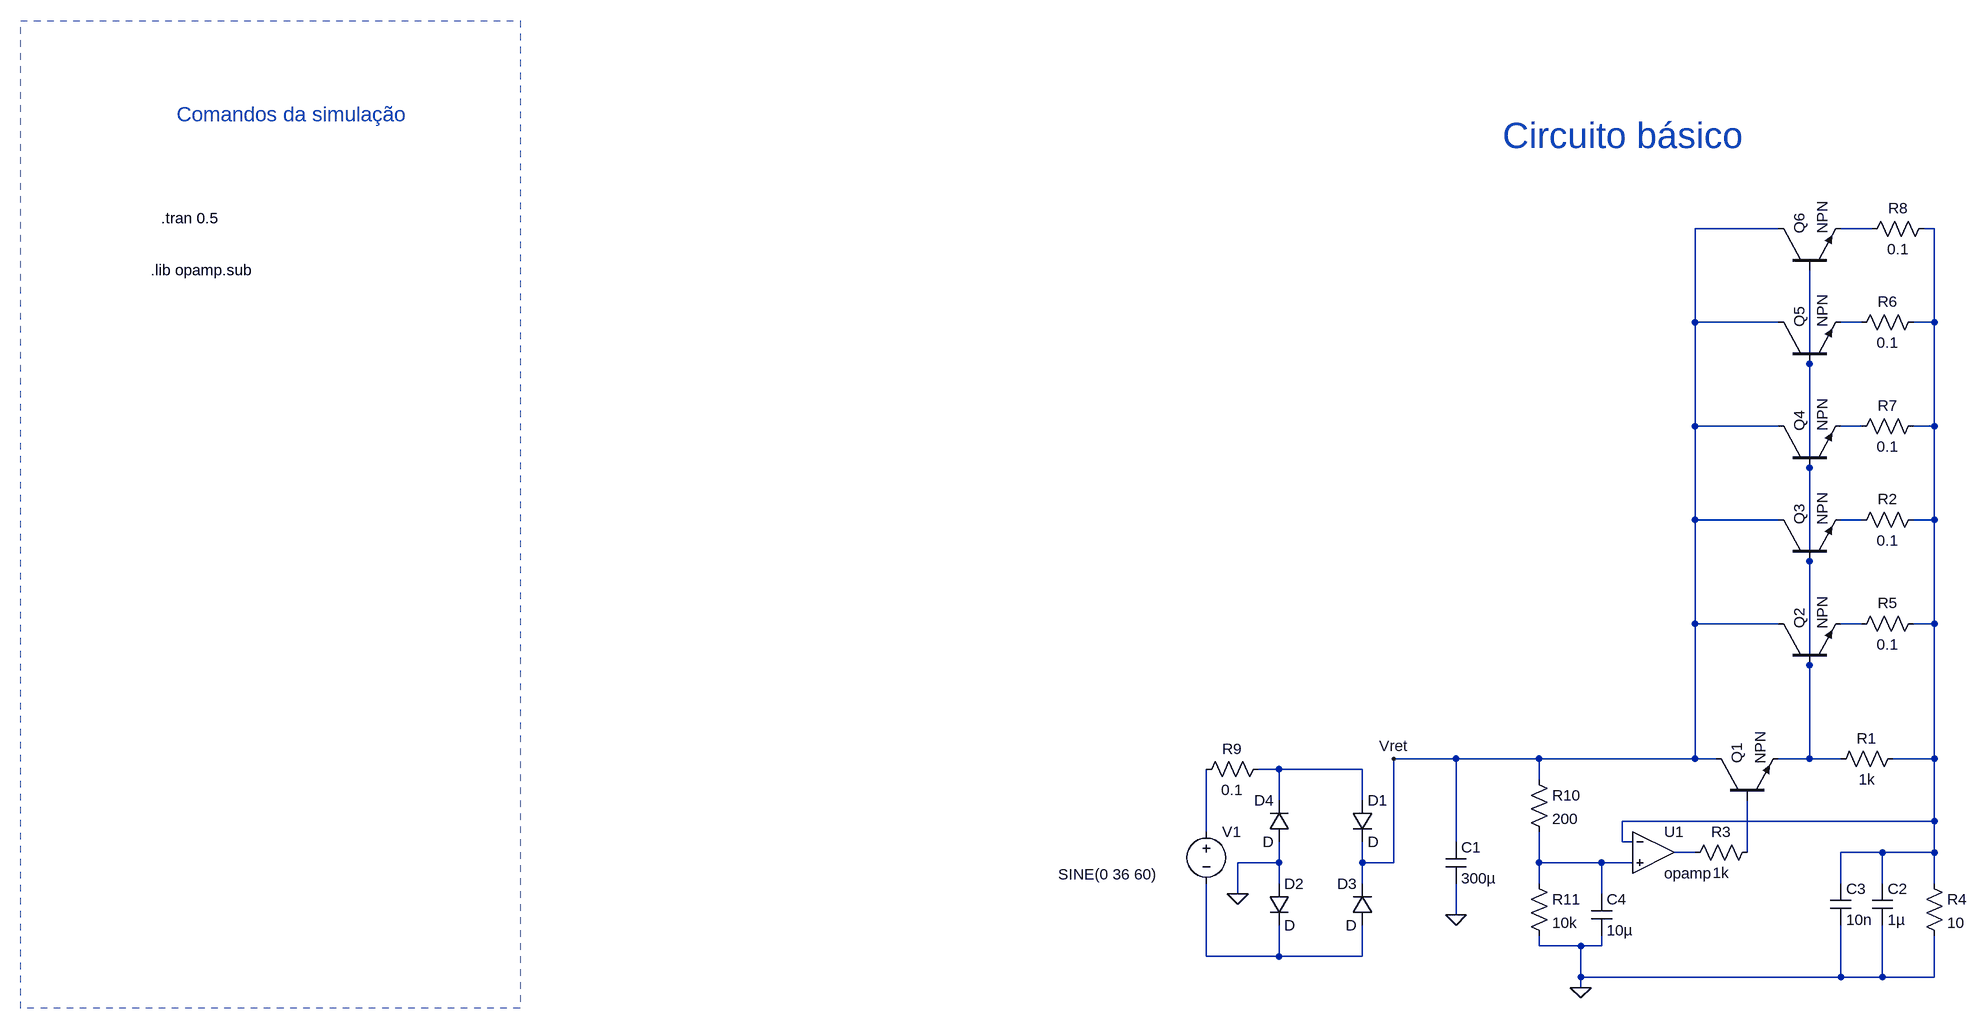
[diagram p0: schematic SimV1.asc]
SimV1.asc, the LTspice schematic file:
Version 4
SHEET 1 4884 2916
WIRE -64 240 -192 240
WIRE 80 240 32 240
WIRE 176 240 160 240
WIRE -192 384 -192 240
WIRE -64 384 -192 384
WIRE 64 384 32 384
WIRE 176 384 176 240
WIRE 176 384 144 384
WIRE -16 448 -16 304
WIRE -192 544 -192 384
WIRE -64 544 -192 544
WIRE 64 544 32 544
WIRE 176 544 176 384
WIRE 176 544 144 544
WIRE -16 608 -16 448
WIRE -192 688 -192 544
WIRE -64 688 -192 688
WIRE 64 688 32 688
WIRE 176 688 176 544
WIRE 176 688 144 688
WIRE -16 752 -16 608
WIRE -192 848 -192 688
WIRE -64 848 -192 848
WIRE 64 848 32 848
WIRE 176 848 176 688
WIRE 176 848 144 848
WIRE -16 912 -16 752
WIRE -560 1056 -656 1056
WIRE -432 1056 -560 1056
WIRE -192 1056 -192 848
WIRE -192 1056 -432 1056
WIRE -160 1056 -192 1056
WIRE -16 1056 -16 912
WIRE -16 1056 -64 1056
WIRE 32 1056 -16 1056
WIRE 176 1056 176 848
WIRE 176 1056 112 1056
WIRE -832 1072 -864 1072
WIRE -704 1072 -832 1072
WIRE -432 1088 -432 1056
WIRE -832 1120 -832 1072
WIRE -704 1120 -704 1072
WIRE 176 1152 176 1056
WIRE 176 1152 -304 1152
WIRE -944 1168 -944 1072
WIRE -560 1184 -560 1056
WIRE -304 1184 -304 1152
WIRE -288 1184 -304 1184
WIRE -192 1200 -224 1200
WIRE -112 1200 -112 1120
WIRE 96 1200 32 1200
WIRE 176 1200 176 1152
WIRE 176 1200 96 1200
WIRE -832 1216 -832 1184
WIRE -832 1216 -896 1216
WIRE -704 1216 -704 1184
WIRE -656 1216 -656 1056
WIRE -656 1216 -704 1216
WIRE -432 1216 -432 1168
WIRE -336 1216 -432 1216
WIRE -288 1216 -336 1216
WIRE -832 1248 -832 1216
WIRE -704 1248 -704 1216
WIRE -432 1248 -432 1216
WIRE 32 1248 32 1200
WIRE 96 1248 96 1200
WIRE 176 1248 176 1200
WIRE -896 1264 -896 1216
WIRE -336 1264 -336 1216
WIRE -560 1296 -560 1248
WIRE -432 1344 -432 1328
WIRE -368 1344 -432 1344
WIRE -336 1344 -336 1328
WIRE -336 1344 -368 1344
WIRE -944 1360 -944 1248
WIRE -832 1360 -832 1312
WIRE -832 1360 -944 1360
WIRE -704 1360 -704 1312
WIRE -704 1360 -832 1360
WIRE -368 1392 -368 1344
WIRE 32 1392 32 1312
WIRE 32 1392 -368 1392
WIRE 96 1392 96 1312
WIRE 96 1392 32 1392
WIRE 176 1392 176 1328
WIRE 176 1392 96 1392
WIRE -368 1408 -368 1392
FLAG -896 1264 0
FLAG -368 1408 0
FLAG -560 1296 0
FLAG -656 1056 Vret
SYMBOL OpAmps\\opamp -256 1136 R0
SYMATTR InstName U1
SYMBOL res 160 1232 R0
SYMATTR InstName R4
SYMATTR Value 10
SYMBOL npn -160 1120 R270
SYMATTR InstName Q1
SYMBOL npn -64 912 R270
SYMATTR InstName Q2
SYMBOL res 128 1040 R90
WINDOW 0 0 56 VBottom 2
WINDOW 3 32 56 VTop 2
SYMATTR InstName R1
SYMATTR Value 1k
SYMBOL voltage -944 1152 R0
WINDOW 3 -228 82 Left 2
WINDOW 123 0 0 Left 0
WINDOW 39 0 0 Left 0
SYMATTR Value SINE(0 36 60)
SYMATTR InstName V1
SYMBOL cap -576 1184 R0
SYMATTR InstName C1
SYMATTR Value 300µ
SYMBOL diode -720 1120 R0
SYMATTR InstName D1
SYMBOL diode -848 1248 R0
SYMATTR InstName D2
SYMBOL diode -688 1312 R180
WINDOW 0 24 64 Left 2
WINDOW 3 24 0 Left 2
SYMATTR InstName D3
SYMBOL diode -816 1184 R180
WINDOW 0 24 64 Left 2
WINDOW 3 24 0 Left 2
SYMATTR InstName D4
SYMBOL cap 80 1248 R0
SYMATTR InstName C2
SYMATTR Value 1µ
SYMBOL res -848 1056 R90
WINDOW 0 0 56 VBottom 2
WINDOW 3 32 56 VTop 2
SYMATTR InstName R9
SYMATTR Value 0.1
SYMBOL cap 16 1248 R0
SYMATTR InstName C3
SYMATTR Value 10n
SYMBOL res -96 1184 R90
WINDOW 0 0 56 VBottom 2
WINDOW 3 32 56 VTop 2
SYMATTR InstName R3
SYMATTR Value 1k
SYMBOL npn -64 752 R270
SYMATTR InstName Q3
SYMBOL res 160 672 R90
WINDOW 0 0 56 VBottom 2
WINDOW 3 32 56 VTop 2
SYMATTR InstName R2
SYMATTR Value 0.1
SYMBOL res 160 832 R90
WINDOW 0 0 56 VBottom 2
WINDOW 3 32 56 VTop 2
SYMATTR InstName R5
SYMATTR Value 0.1
SYMBOL npn -64 608 R270
SYMATTR InstName Q4
SYMBOL npn -64 448 R270
SYMATTR InstName Q5
SYMBOL res 160 368 R90
WINDOW 0 0 56 VBottom 2
WINDOW 3 32 56 VTop 2
SYMATTR InstName R6
SYMATTR Value 0.1
SYMBOL res 160 528 R90
WINDOW 0 0 56 VBottom 2
WINDOW 3 32 56 VTop 2
SYMATTR InstName R7
SYMATTR Value 0.1
SYMBOL npn -64 304 R270
SYMATTR InstName Q6
SYMBOL res 176 224 R90
WINDOW 0 0 56 VBottom 2
WINDOW 3 32 56 VTop 2
SYMATTR InstName R8
SYMATTR Value 0.1
SYMBOL res -448 1072 R0
SYMATTR InstName R10
SYMATTR Value 200
SYMBOL res -448 1232 R0
SYMATTR InstName R11
SYMATTR Value 10k
SYMBOL cap -352 1264 R0
SYMATTR InstName C4
SYMATTR Value 10µ
TEXT -2568 304 Left 2 !.lib opamp.sub
TEXT -2552 224 Left 2 !.tran 0.5
TEXT -488 96 Left 5 ;Circuito básico
TEXT -2528 64 Left 3 ;Comandos da simulação
RECTANGLE Normal -2000 1440 -2768 -80 2

The netlist it stands for:
* SimV1.asc
XU1 N002 N012 N010 opamp Aol=100K GBW=10Meg  ; pins invin noninvin out
R4 N002 0 10
Q1 Vret N011 N004 0 NPN
Q2 Vret N004 N007 0 NPN
R1 N002 N004 1k
V1 N009 N013 SINE(0 36 60)
C1 Vret 0 300µ
D1 N008 Vret D
D2 0 N013 D
D3 N013 Vret D
D4 0 N008 D
C2 N002 0 1µ
R9 N008 N009 0.1
C3 N002 0 10n
R3 N011 N010 1k
Q3 Vret N004 N006 0 NPN
R2 N002 N006 0.1
R5 N002 N007 0.1
Q4 Vret N004 N005 0 NPN
Q5 Vret N004 N003 0 NPN
R6 N002 N003 0.1
R7 N002 N005 0.1
Q6 Vret N004 N001 0 NPN
R8 N002 N001 0.1
R10 Vret N012 200
R11 N012 0 10k
C4 N012 0 10µ
.model D D
.lib standard.dio
.model NPN NPN
.model PNP PNP
.lib standard.bjt
.lib opamp.sub
.tran 0.5
* Circuito básico
* Comandos da simulação
.backanno
.end